# Altium project bailey-x.PrjPcb (part 6 of 8)
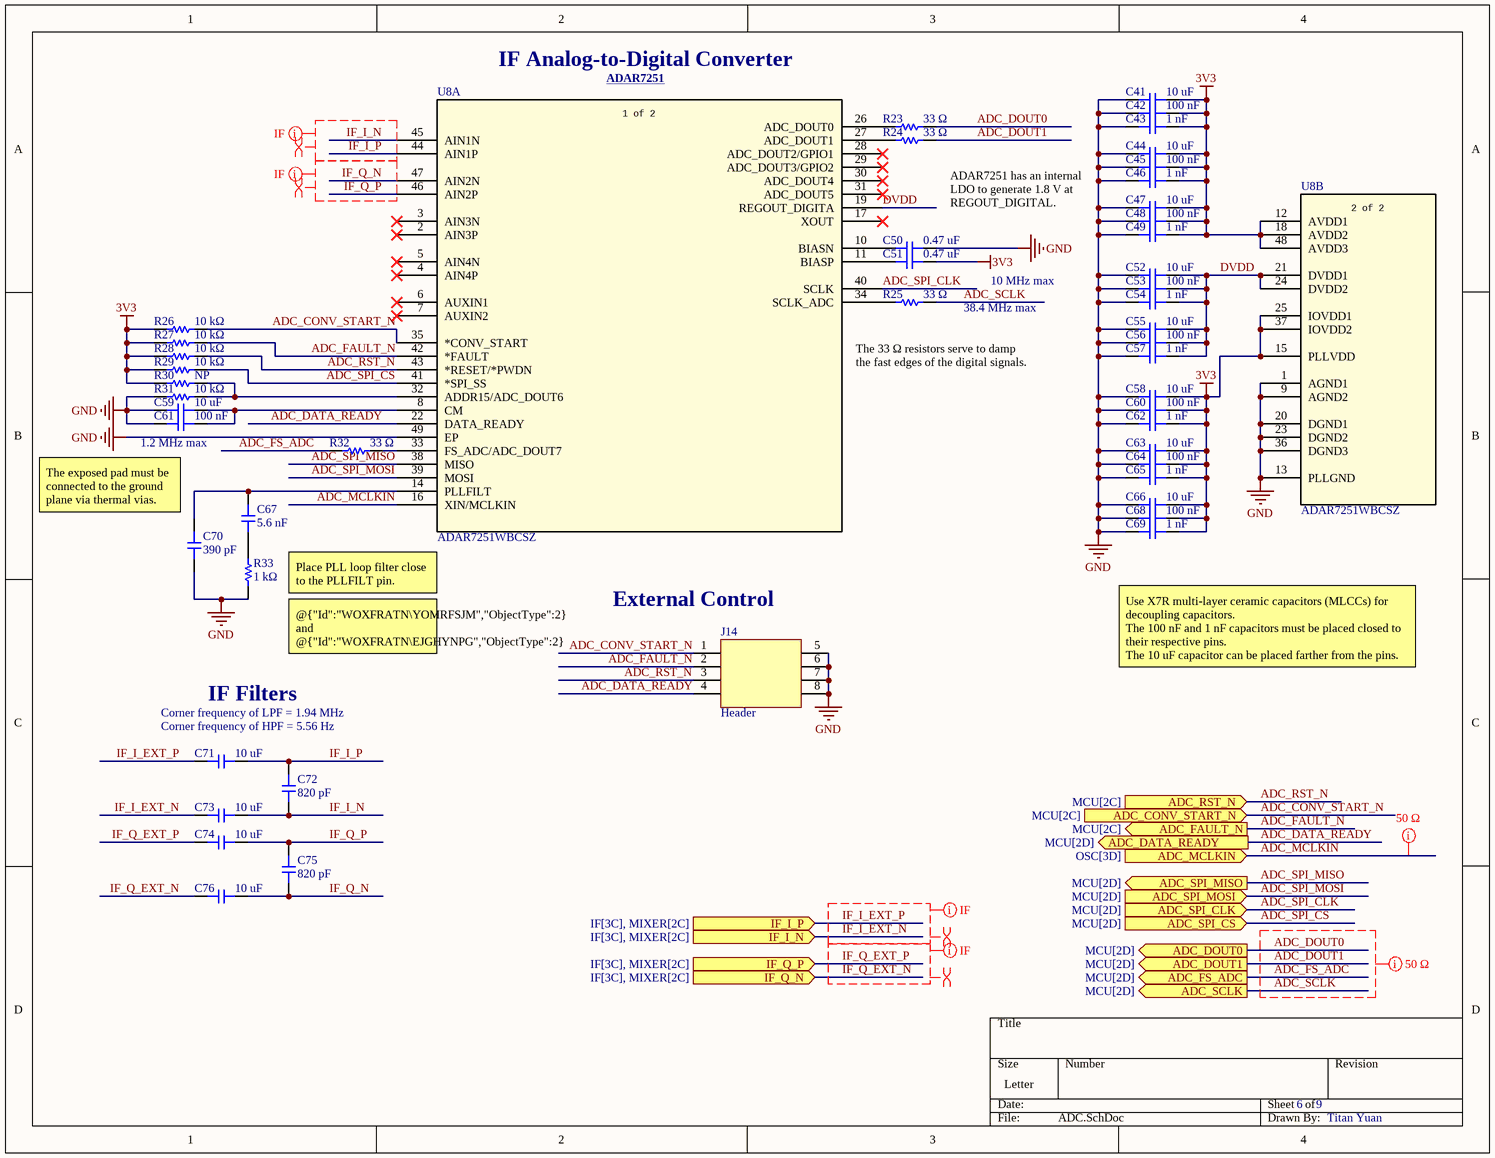
[diagram p12: ADC.SchDoc]

## Sheet ADC.SchDoc (continued)

### Library data of the parts (continued)
R26-R29 R31 = RES: Res Thick Film 0402 10K Ohm 1% 0.063W(1/16W) ±100ppm/C Pad SMD T/R; Manufacturer: Yageo; Manufacturer Part Number: RC0402FR-0710KL; Power Dissipation: 62.5mW; Power Rating: 63mW; Value: 10kΩ; Temperature Coefficient: 100ppm/°C; Voltage Rating: 50V; Tolerance: 1%; Package Size: 0402; Supplier: DigiKey; Supplier Part Number: 311-10.0KLRCT-ND; RoHS: Compliant; Category: Chip SMD Resistors; Stock: 9059080; Pricing: 1=0.1, 10=0.012, 25=0.0092, 50=0.0062, 100=0.0056, 250=0.00472, 500=0.00328, 10000=0.00204, 20000=0.00153 (USD); Case/Package: 0402; Case Code (Imperial): 0402; Case Code (Metric): 0402; China RoHS: Non-Compliant; Composition: Thick Film; Country of Origin: Mainland China, Taiwan; Depth: 500µm; Export Control Classification Number (ECCN) Code: EAR99; Height: 350µm; Harmonized Tariff Schedule (HTS) Code: 8533.21.00.30; Introduction Date: 2004-10-04; Lead Free: Lead Free; Lead Pitch: 200µm; Length: 1mm; Lifecycle Status: Production; Max Operating Temperature: 155°C; Military Standard: Not; Min Operating Temperature: -55°C; Mounting Technology: Surface Mount; Pins: 2; Number of Terminals: 2; Number of Terminations: 2; Packaging: Tape & Reel; REACH SVHC: Yes; Schedule B: 8533210045, 8533210045|8533210045|8533210045|8533210045|8533210045|8533210045|8533210045|8533210045|8533210045|8533210045|8533210045|8533210045|8533210045|8533210045, 8533210045|8533210045|8533210045|8533210045|8533210045|8533210045|8533210045|8533210045|8533210045|8533210045|8533210045|8533210045|8533210045|8533210045|8533210045, 8533210045|8533210045|8533210045|8533210045|8533210045|8533210045|8533210045|8533210045|8533210045|8533210045|8533210045|8533210045|8533210045|8533210045|8533210045|8533210045; Termination: SMD/SMT; Voltage Rating (DC): 50V; Width: 500µm; Working Voltage: 50V; ComponentLink1URL: https://datasheet.octopart.com:443/RC0402FR-0710KL-Yageo-datasheet-175887523.pdf?src-supplier=Newark; ComponentLink1Description: https://datasheet.octopart.com:443/RC0402FR-0710KL-Yageo-datasheet-175887523.pdf?src-supplier=Newark; ComponentLink2URL: https://datasheet.octopart.com:443/RC0402FR-0710KL-Yageo-datasheet-12531192.pdf?src-supplier=Newark; ComponentLink2Description: https://datasheet.octopart.com:443/RC0402FR-0710KL-Yageo-datasheet-12531192.pdf?src-supplier=Newark; ComponentLink3URL: https://datasheet.octopart.com:443/RC0402FR-0710KL-Yageo-datasheet-8324527.pdf?src-supplier=Newark; ComponentLink3Description: https://datasheet.octopart.com:443/RC0402FR-0710KL-Yageo-datasheet-8324527.pdf?src-supplier=Newark; ComponentLink4URL: https://datasheet.octopart.com:443/RC0402FR-0710KL-Yageo-datasheet-10408619.pdf?src-supplier=element14+APAC; ComponentLink4Description: https://datasheet.octopart.com:443/RC0402FR-0710KL-Yageo-datasheet-10408619.pdf?src-supplier=element14+APAC; ComponentLink5URL: https://datasheet.octopart.com:443/RC0402FR-0710KL-Yageo-datasheet-62067350.pdf?src-supplier=element14+APAC; ComponentLink5Description: https://datasheet.octopart.com:443/RC0402FR-0710KL-Yageo-datasheet-62067350.pdf?src-supplier=element14+APAC; ComponentLink6URL: https://datasheet.octopart.com:443/RC0402FR-0710KL-Yageo-datasheet-21426659.pdf?src-supplier=element14+APAC; ComponentLink6Description: https://datasheet.octopart.com:443/RC0402FR-0710KL-Yageo-datasheet-21426659.pdf?src-supplier=element14+APAC; ComponentLink7URL: https://datasheet.octopart.com:443/RC0402FR-0710KL-Yageo-datasheet-164759695.pdf?src-supplier=Upverter; ComponentLink7Description: https://datasheet.octopart.com:443/RC0402FR-0710KL-Yageo-datasheet-164759695.pdf?src-supplier=Upverter; ComponentLink8URL: https://datasheet.octopart.com:443/RC0402FR-0710KL-Yageo-datasheet-103092701.pdf?src-supplier=Upverter; ComponentLink8Description: https://datasheet.octopart.com:443/RC0402FR-0710KL-Yageo-datasheet-103092701.pdf?src-supplier=Upverter; ComponentLink9URL: https://sigma.octopart.com:443/138820526/technical_drawing/Yageo-RC0402FR-0710KL.pdf?src-supplier=Upverter; ComponentLink9Description: https://sigma.octopart.com:443/138820526/technical_drawing/Yageo-RC0402FR-0710KL.pdf?src-supplier=Upverter; ComponentLink10URL: https://datasheet.octopart.com:443/RC0402FR-0710KL-Yageo-datasheet-98239111.pdf?src-supplier=Upverter; ComponentLink10Description: https://datasheet.octopart.com:443/RC0402FR-0710KL-Yageo-datasheet-98239111.pdf?src-supplier=Upverter; ComponentLink11URL: https://datasheet.octopart.com:443/RC0402FR-0710KL-Yageo-datasheet-68298067.pdf?src-supplier=Upverter; ComponentLink11Description: https://datasheet.octopart.com:443/RC0402FR-0710KL-Yageo-datasheet-68298067.pdf?src-supplier=Upverter; ComponentLink12URL: https://datasheet.octopart.com:443/RC0402FR-0710KL-Yageo-datasheet-68297981.pdf?src-supplier=Upverter; ComponentLink12Description: https://datasheet.octopart.com:443/RC0402FR-0710KL-Yageo-datasheet-68297981.pdf?src-supplier=Upverter; ComponentLink13URL: https://datasheet.octopart.com:443/RC0402FR-0710KL-Yageo-datasheet-141435361.pdf?src-supplier=Upverter; ComponentLink13Description: https://datasheet.octopart.com:443/RC0402FR-0710KL-Yageo-datasheet-141435361.pdf?src-supplier=Upverter; ComponentLink14URL: https://datasheet.octopart.com:443/RC0402FR-0710KL-Yageo-datasheet-12509768.pdf?src-supplier=Upverter; ComponentLink14Description: https://datasheet.octopart.com:443/RC0402FR-0710KL-Yageo-datasheet-12509768.pdf?src-supplier=Upverter; ComponentLink15URL: https://datasheet.octopart.com:443/RC0402FR-0710KL-Yageo-Group-datasheet-190305687.pdf?src-supplier=Future+Electronics; ComponentLink15Description: https://datasheet.octopart.com:443/RC0402FR-0710KL-Yageo-Group-datasheet-190305687.pdf?src-supplier=Future+Electronics; ComponentLink16URL: https://datasheet.octopart.com:443/RC0402FR-0710KL-Yageo-datasheet-137700087.pdf?src-supplier=Future+Electronics; ComponentLink16Description: https://datasheet.octopart.com:443/RC0402FR-0710KL-Yageo-datasheet-137700087.pdf?src-supplier=Future+Electronics; ComponentLink17URL: https://datasheet.octopart.com:443/RC0402FR-0710KL-Yageo-datasheet-8324255.pdf?src-supplier=Future+Electronics; ComponentLink17Description: https://datasheet.octopart.com:443/RC0402FR-0710KL-Yageo-datasheet-8324255.pdf?src-supplier=Future+Electronics; ComponentLink18URL: https://datasheet.octopart.com:443/RC0402FR-0710KL-Yageo-datasheet-8329306.pdf?src-supplier=element14; ComponentLink18Description: https://datasheet.octopart.com:443/RC0402FR-0710KL-Yageo-datasheet-8329306.pdf?src-supplier=element14; ComponentLink19URL: https://datasheet.octopart.com:443/RC0402FR-0710KL-Yageo-datasheet-505231.pdf?src-supplier=element14; ComponentLink19Description: https://datasheet.octopart.com:443/RC0402FR-0710KL-Yageo-datasheet-505231.pdf?src-supplier=element14; ComponentLink20URL: https://datasheet.octopart.com:443/RC0402FR-0710KL-Yageo-datasheet-175423674.pdf?src-supplier=SOS+electronic; ComponentLink20Description: https://datasheet.octopart.com:443/RC0402FR-0710KL-Yageo-datasheet-175423674.pdf?src-supplier=SOS+electronic; ComponentLink21URL: https://datasheet.octopart.com:443/RC0402FR-0710KL-Yageo-datasheet-79472498.pdf?src-supplier=Megastar; ComponentLink21Description: https://datasheet.octopart.com:443/RC0402FR-0710KL-Yageo-datasheet-79472498.pdf?src-supplier=Megastar; ComponentLink22URL: https://datasheet.octopart.com/RC0402FR-0710KL-Yageo-datasheet-73766026.pdf; ComponentLink22Description: https://datasheet.octopart.com/RC0402FR-0710KL-Yageo-datasheet-73766026.pdf; ComponentLink23URL: http://sigma.octopart.com:80/conflict_mineral_statement/Yageo-company-3.pdf?src-supplier=Compliance+Statements; ComponentLink23Description: http://sigma.octopart.com:80/conflict_mineral_statement/Yageo-company-3.pdf?src-supplier=Compliance+Statements; ComponentLink24URL: http://sigma.octopart.com:80/rohs_statement/Yageo-company-2.pdf?src-supplier=Compliance+Statements; ComponentLink24Description: http://sigma.octopart.com:80/rohs_statement/Yageo-company-2.pdf?src-supplier=Compliance+Statements
R30 = RES: Resistor SMD Generic; Manufacturer: *; Manufacturer Part Number: *; Tolerance: *; Voltage Rating: *; Package Size: 0402
R33 = RES: Res Thin Film 0402 1K Ohm 0.1% 0.063W(1/16W) ±25ppm/C Pad SMD T/R; Manufacturer: Yageo; Manufacturer Part Number: RT0402BRD071KL; Max Power Dissipation: 63mW; Power Dissipation: 62.5mW; Value: 1kΩ; Temperature Coefficient: 25ppm/°C; Voltage Rating: 50V; Tolerance: 0.1%; Package Size: 0402; Supplier: DigiKey; Supplier Part Number: YAG1386CT-ND; RoHS: Compliant; Category: Chip SMD Resistors; Stock: 241072; Pricing: 1=0.1, 10=0.061, 25=0.0592, 50=0.0572, 100=0.0556, 250=0.05408, 500=0.04692, 1000=0.04567 (USD); Case/Package: 0402; Case Code (Imperial): 0402; China RoHS: Non-Compliant; Composition: Thin Film; Depth: 500µm; Features: Moisture Resistant; Height: 300µm; Lead Free: Lead Free; Length: 1mm; Lifecycle Status: Production; Max Operating Temperature: 155°C; Military Standard: Not; Min Operating Temperature: -55°C; Mounting Technology: Surface Mount; Number of Terminals: 2; Number of Terminations: 2; Power Rating: 63mW; REACH SVHC: Yes; Schedule B: 8533210045, 8533210045|8533210045|8533210045|8533210045|8533210045|8533210045|8533210045|8533210045|8533210045|8533210045|8533210045|8533210045|8533210045, 8533210045|8533210045|8533210045|8533210045|8533210045|8533210045|8533210045|8533210045|8533210045|8533210045|8533210045|8533210045|8533210045|8533210045, 8533210045|8533210045|8533210045|8533210045|8533210045|8533210045|8533210045|8533210045|8533210045|8533210045|8533210045|8533210045|8533210045|8533210045|8533210045; Termination: SMD/SMT; Voltage Rating (DC): 50V; Weight: 652.039032µg; Width: 500µm; Working Voltage: 50V; ComponentLink1URL: https://datasheet.octopart.com:443/RT0402BRD071KL-Yageo-datasheet-176402239.pdf?src-supplier=Future+Electronics; ComponentLink1Description: https://datasheet.octopart.com:443/RT0402BRD071KL-Yageo-datasheet-176402239.pdf?src-supplier=Future+Electronics; ComponentLink2URL: https://datasheet.octopart.com:443/RT0402BRD071KL-Yageo-datasheet-169971040.pdf?src-supplier=Future+Electronics; ComponentLink2Description: https://datasheet.octopart.com:443/RT0402BRD071KL-Yageo-datasheet-169971040.pdf?src-supplier=Future+Electronics; ComponentLink3URL: https://datasheet.octopart.com:443/RT0402BRD071KL-Yageo-datasheet-166250672.pdf?src-supplier=Future+Electronics; ComponentLink3Description: https://datasheet.octopart.com:443/RT0402BRD071KL-Yageo-datasheet-166250672.pdf?src-supplier=Future+Electronics; ComponentLink4URL: https://datasheet.octopart.com:443/RT0402BRD071KL-Yageo-datasheet-136673517.pdf?src-supplier=Future+Electronics; ComponentLink4Description: https://datasheet.octopart.com:443/RT0402BRD071KL-Yageo-datasheet-136673517.pdf?src-supplier=Future+Electronics; ComponentLink5URL: https://datasheet.octopart.com:443/RT0402BRD071KL-Yageo-datasheet-137700930.pdf?src-supplier=Future+Electronics; ComponentLink5Description: https://datasheet.octopart.com:443/RT0402BRD071KL-Yageo-datasheet-137700930.pdf?src-supplier=Future+Electronics; ComponentLink6URL: https://datasheet.octopart.com:443/RT0402BRD071KL-Yageo-datasheet-96443642.pdf?src-supplier=Future+Electronics; ComponentLink6Description: https://datasheet.octopart.com:443/RT0402BRD071KL-Yageo-datasheet-96443642.pdf?src-supplier=Future+Electronics; ComponentLink7URL: https://datasheet.octopart.com:443/RT0402BRD071KL-Yageo-datasheet-12594463.pdf?src-supplier=Future+Electronics; ComponentLink7Description: https://datasheet.octopart.com:443/RT0402BRD071KL-Yageo-datasheet-12594463.pdf?src-supplier=Future+Electronics; ComponentLink8URL: https://datasheet.octopart.com:443/RT0402BRD071KL-Yageo-datasheet-8324589.pdf?src-supplier=Future+Electronics; ComponentLink8Description: https://datasheet.octopart.com:443/RT0402BRD071KL-Yageo-datasheet-8324589.pdf?src-supplier=Future+Electronics; ComponentLink9URL: https://datasheet.octopart.com:443/RT0402BRD071KL-Yageo-datasheet-34924148.pdf?src-supplier=Future+Electronics; ComponentLink9Description: https://datasheet.octopart.com:443/RT0402BRD071KL-Yageo-datasheet-34924148.pdf?src-supplier=Future+Electronics; ComponentLink10URL: https://datasheet.octopart.com:443/RT0402BRD071KL-Yageo-datasheet-141265893.pdf?src-supplier=ODG+(Origin+Data+Global); ComponentLink10Description: https://datasheet.octopart.com:443/RT0402BRD071KL-Yageo-datasheet-141265893.pdf?src-supplier=ODG+(Origin+Data+Global); ComponentLink11URL: https://sigma.octopart.com:443/138820526/technical_drawing/Yageo-RT0402BRD071KL.pdf?src-supplier=Upverter; ComponentLink11Description: https://sigma.octopart.com:443/138820526/technical_drawing/Yageo-RT0402BRD071KL.pdf?src-supplier=Upverter; ComponentLink12URL: https://datasheet.octopart.com:443/RT0402BRD071KL-Yageo-datasheet-10915759.pdf?src-supplier=TME; ComponentLink12Description: https://datasheet.octopart.com:443/RT0402BRD071KL-Yageo-datasheet-10915759.pdf?src-supplier=TME; ComponentLink13URL: https://datasheet.octopart.com:443/RT0402BRD071KL-Yageo-datasheet-164439670.pdf?src-supplier=Newark; ComponentLink13Description: https://datasheet.octopart.com:443/RT0402BRD071KL-Yageo-datasheet-164439670.pdf?src-supplier=Newark; ComponentLink14URL: https://datasheet.octopart.com:443/RT0402BRD071KL-Yageo-datasheet-120102479.pdf?src-supplier=Megastar; ComponentLink14Description: https://datasheet.octopart.com:443/RT0402BRD071KL-Yageo-datasheet-120102479.pdf?src-supplier=Megastar; ComponentLink15URL: https://datasheet.octopart.com/RT0402BRD071KL-Yageo-datasheet-86813807.pdf; ComponentLink15Description: https://datasheet.octopart.com/RT0402BRD071KL-Yageo-datasheet-86813807.pdf; ComponentLink16URL: http://sigma.octopart.com:80/conflict_mineral_statement/Yageo-company-3.pdf?src-supplier=Compliance+Statements; ComponentLink16Description: http://sigma.octopart.com:80/conflict_mineral_statement/Yageo-company-3.pdf?src-supplier=Compliance+Statements; ComponentLink17URL: http://sigma.octopart.com:80/rohs_statement/Yageo-company-2.pdf?src-supplier=Compliance+Statements; ComponentLink17Description: http://sigma.octopart.com:80/rohs_statement/Yageo-company-2.pdf?src-supplier=Compliance+Statements
U8 = ADAR7251WBCSZ: 4-Channel Quad ADC Delta-Sigma 1.8Msps 16-bit Parallel/Serial Automotive 48-Pin LFCSP EP T/R; Manufacturer_Name: Analog Devices Inc; Manufacturer: Analog Devices; Manufacturer Lifecycle Status: NOT RECOMMENDED FOR NEW DESIGN; Interface: Parallel, SPI; Number of A/D Converters: 4; Number of Bits: 16; Copyright: Copyright (C) 2025 Ultra Librarian. All rights reserved.; Manufacturer_Part_Number: ADAR7251WBCSZ; Datasheet: https://www.analog.com/media/en/technical-documentation/data-sheets/ADAR7251.pdf; RefDes: RefDes; Type: Type; Supplier: Arrow Electronics; Supplier Part Number: ADAR7251WBCSZ-RL; Manufacturer Part Number: ADAR7251WBCSZ; RoHS: Compliant; Category: Analog to Digital Converters (ADCs); Stock: 1518; Pricing: 1=17.58, 10=17.31, 25=17.04, 100=16.77, 250=16.49, 500=16.22, 1000=15.95 (USD); Case/Package: QFN; Lead Free: Contains Lead; Lifecycle Status: Production; Max Operating Temperature: 125°C; Min Operating Temperature: -40°C; Number of Inputs: 4; Pins: 48; Packaging: Tape and Reel; Sampling Rate: 1.8Msps; Schedule B: 8542390000, 8542390000|8542390000|8542390000|8542390000|8542390000; ComponentLink1URL: https://datasheet.octopart.com:443/ADAR7251WBCSZ-RL-Analog-Devices-datasheet-37108182.pdf?src-supplier=Upverter; ComponentLink1Description: https://datasheet.octopart.com:443/ADAR7251WBCSZ-RL-Analog-Devices-datasheet-37108182.pdf?src-supplier=Upverter; ComponentLink2URL: https://octopart.com:443/opatz8j6/c1?t=CQmgxgzF3TS1DSQPN3cDiG0EYWfU1hgwPhmTexDVZLnR1yZQOElAuyPbML9mgDJkPVxpVD3gYcoY03UYbhc9VkRaca9L0HaHtXuMsNFf2r7kStaMExwc3y8Qy8XWZPSfY4husBBcSXxc0bo4wKO_VIhVldzI7K2uCW-t-YqmoWcieXASzNGiaG2Bub2XzkGmAw1BAALsiXjrYth_GIRcMxKMuexNTsFZxWzEW-RJC1yoCn1dh43rOqnwSWnkt7ugxSJEi6_2jxpsji6pZNy2X20IdN1ynU6w9VyR75RcBgi_pduDOVpUW0AX&src-supplier=Analog+Devices; ComponentLink2Description: https://octopart.com:443/opatz8j6/c1?t=CQmgxgzF3TS1DSQPN3cDiG0EYWfU1hgwPhmTexDVZLnR1yZQOElAuyPbML9mgDJkPVxpVD3gYcoY03UYbhc9VkRaca9L0HaHtXuMsNFf2r7kStaMExwc3y8Qy8XWZPSfY4husBBcSXxc0bo4wKO_VIhVldzI7K2uCW-t-YqmoWcieXASzNGiaG2Bub2XzkGmAw1BAALsiXjrYth_GIRcMxKMuexNTsFZxWzEW-RJC1yoCn1dh43rOqnwSWnkt7ugxSJEi6_2jxpsji6pZNy2X20IdN1ynU6w9VyR75RcBgi_pduDOVpUW0AX&src-supplier=Analog+Devices; ComponentLink3URL: https://datasheet.octopart.com:443/ADAR7251WBCSZ-RL-Analog-Devices-datasheet-79793795.pdf?src-supplier=SHENGYU+ELECTRONICS; ComponentLink3Description: https://datasheet.octopart.com:443/ADAR7251WBCSZ-RL-Analog-Devices-datasheet-79793795.pdf?src-supplier=SHENGYU+ELECTRONICS; ComponentLink4URL: http://sigma.octopart.com:80/conflict_mineral_statement/Analog-Devices-company-33.pdf?src-supplier=Compliance+Statements; ComponentLink4Description: http://sigma.octopart.com:80/conflict_mineral_statement/Analog-Devices-company-33.pdf?src-supplier=Compliance+Statements; ComponentLink5URL: https://octopart.com:443/opatz8j6/c1?t=QP5QRZ8fNHIlvGQJKDbEcehpvKXZdY016AwOjUrM50DrZC_R-f1Pg-EuaWOyKDZH9OBd7dWivR_i3nk3Xo26w2sGsBnPhkVsSzYG81pmL3ea60Kmr0a8UUo0ZL-YYfNFq7KTASlEeG1WvdeIoSBT5hBvzH64l4FkDtEivSQbImbmNw6Y08ax0d8WdYuFh5ejQZzFivnYTWpTOoJzNsRVn8w6iClEFe_CmzJzioseeE7rWrtas6d9CbFF5KEvx48S6-N7O0YoKKepe4BUbaANJTYqghQhF1t7el8qVACiHhz-ck11jaWvVU3U&src-supplier=Compliance+Statements; ComponentLink5Description: https://octopart.com:443/opatz8j6/c1?t=QP5QRZ8fNHIlvGQJKDbEcehpvKXZdY016AwOjUrM50DrZC_R-f1Pg-EuaWOyKDZH9OBd7dWivR_i3nk3Xo26w2sGsBnPhkVsSzYG81pmL3ea60Kmr0a8UUo0ZL-YYfNFq7KTASlEeG1WvdeIoSBT5hBvzH64l4FkDtEivSQbImbmNw6Y08ax0d8WdYuFh5ejQZzFivnYTWpTOoJzNsRVn8w6iClEFe_CmzJzioseeE7rWrtas6d9CbFF5KEvx48S6-N7O0YoKKepe4BUbaANJTYqghQhF1t7el8qVACiHhz-ck11jaWvVU3U&src-supplier=Compliance+Statements

## Sheet OSC.SchDoc
size Letter; DrawnBy: Titan Yuan; SheetNumber: 7; SheetTotal: 9
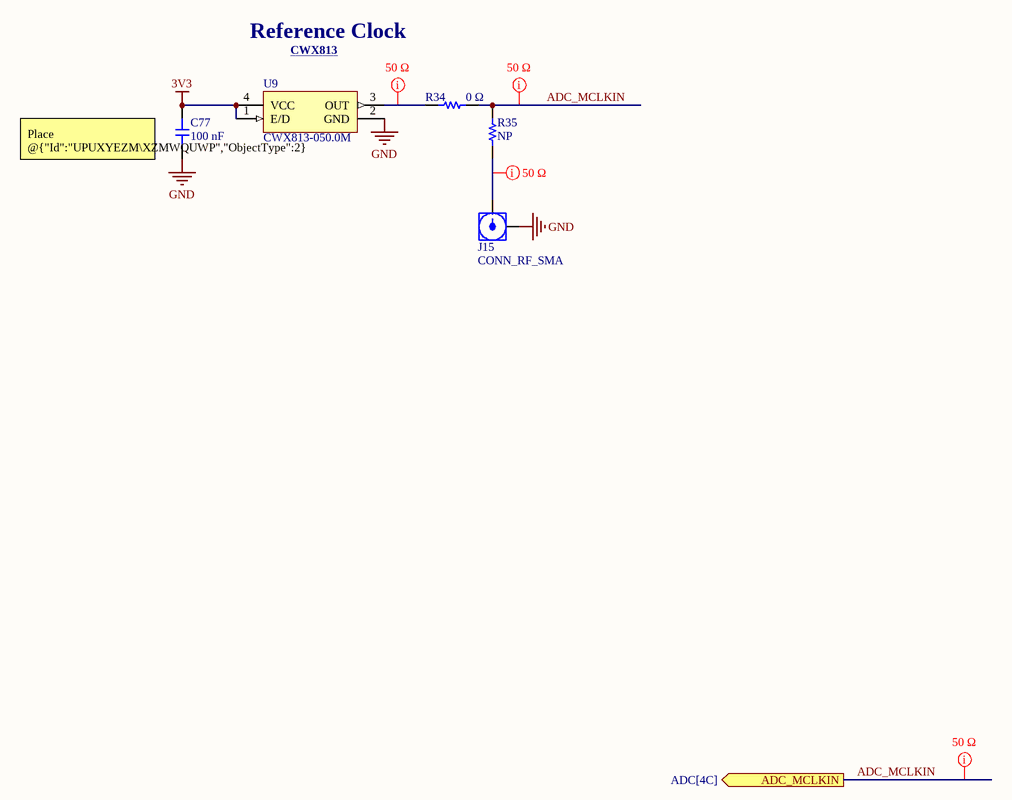
[diagram p6: OSC.SchDoc]

### Parts
C77  100 nF  [CAP_0402]
J15  CONN_RF_SMA  [142-0701-801]
R34  0 Ω  [RES_0402]
R35  NP  [RES_0402]
U9  CWX813-050.0M  [CWX8XX]

### Ports
ADC_MCLKIN (out, see ADC[4C])

### Nets
3V3: C77.2 U9.1(E/D) U9.4(VCC)
GND: C77.1 J15.2 U9.2(GND)
ADC_MCLKIN: R34.2 R35.2 ; port ADC_MCLKIN
NetJ15_1: J15.1 R35.1
NetR34_1: R34.1 U9.3(OUT)

### Layout directives
net class 50 Ω: ADC_MCLKIN, NetJ15_1, NetR34_1

### Notes on the sheet
- Reference Clock
- (near U9) CWX813 <https://www.conwin.com/datasheets/sm/sm111.pdf>
- (near C77) Place @{"Id":"UPUXYEZM\XZMWQUWP","ObjectType":2} right next to pin 2 of @{"Id":"UPUXYEZM\QIVNDBVN","ObjectType":2}.

### Library data of the parts
C77 = CAP: Ceramic Capacitor, Ceramic, 50V, 10% +Tol, 10% -Tol, X7R, 15% TC, 0.1uF, Surface Mount, 0402; Manufacturer: Yageo; Manufacturer Part Number: CC0402KPX7R9BB104; Tolerance: +-10%; Value: 100nF; Voltage Rating: 50 V; Dielectric: Ceramic; Package Size: 0402; Supplier: DigiKey; Supplier Part Number: 13-CC0402KPX7R9BB104CT-ND; RoHS: Compliant; Category: Ceramic Capacitors; Stock: 40680; Pricing: 1=0.1, 10=0.053, 50=0.0364, 100=0.0313, 500=0.02292, 1000=0.02035, 2500=0.01764, 5000=0.01601 (USD); Case/Package: 0402; China RoHS: Compliant; Dielectric Material: Ceramic; Height: 500µm; Lead Free: Lead Free; Length: 1mm; Lifecycle Status: Production; Max Operating Temperature: 125°C; Min Operating Temperature: -55°C; Mounting Technology: Surface Mount; Number of Terminals: 2; REACH SVHC: Yes; Voltage Rating (DC): 50V; Width: 500µm; ComponentLink1URL: https://datasheet.octopart.com:443/CC0402KPX7R9BB104-Yageo-datasheet-177165144.pdf?src-supplier=IHS; ComponentLink1Description: https://datasheet.octopart.com:443/CC0402KPX7R9BB104-Yageo-datasheet-177165144.pdf?src-supplier=IHS; ComponentLink2URL: https://datasheet.octopart.com:443/CC0402KPX7R9BB104-Yageo-Group-datasheet-189192896.pdf?src-supplier=Future+Electronics; ComponentLink2Description: https://datasheet.octopart.com:443/CC0402KPX7R9BB104-Yageo-Group-datasheet-189192896.pdf?src-supplier=Future+Electronics; ComponentLink3URL: https://datasheet.octopart.com:443/CC0402KPX7R9BB104-Yageo-datasheet-181967134.pdf?src-supplier=Farnell; ComponentLink3Description: https://datasheet.octopart.com:443/CC0402KPX7R9BB104-Yageo-datasheet-181967134.pdf?src-supplier=Farnell; ComponentLink4URL: https://datasheet.octopart.com/Surface-Mount-Ceramic-Multilayer-Capacitors%3B-General-Purpose-%26-High-Capacitance-Class-2%2C-X7R-Yageo-datasheet-family-114.pdf; ComponentLink4Description: https://datasheet.octopart.com/Surface-Mount-Ceramic-Multilayer-Capacitors%3B-General-Purpose-%26-High-Capacitance-Class-2%2C-X7R-Yageo-datasheet-family-114.pdf; ComponentLink5URL: https://datasheet.octopart.com/CC0402KPX7R9BB104-Yageo-datasheet-10883670.pdf; ComponentLink5Description: https://datasheet.octopart.com/CC0402KPX7R9BB104-Yageo-datasheet-10883670.pdf; ComponentLink6URL: http://sigma.octopart.com:80/rohs_statement/Surface-Mount-Ceramic-Multilayer-Capacitors%3B-General-Purpose-%26-High-Capacitance-Class-2%2C-X7R-Yageo-family-124.pdf?src-supplier=Compliance+Statements; ComponentLink6Description: http://sigma.octopart.com:80/rohs_statement/Surface-Mount-Ceramic-Multilayer-Capacitors%3B-General-Purpose-%26-High-Capacitance-Class-2%2C-X7R-Yageo-family-124.pdf?src-supplier=Compliance+Statements; ComponentLink7URL: http://sigma.octopart.com:80/reach_statement/Surface-Mount-Ceramic-Multilayer-Capacitors%3B-General-Purpose-%26-High-Capacitance-Class-2%2C-X7R-Yageo-family-125.pdf?src-supplier=Compliance+Statements; ComponentLink7Description: http://sigma.octopart.com:80/reach_statement/Surface-Mount-Ceramic-Multilayer-Capacitors%3B-General-Purpose-%26-High-Capacitance-Class-2%2C-X7R-Yageo-family-125.pdf?src-supplier=Compliance+Statements; ComponentLink8URL: http://sigma.octopart.com:80/conflict_mineral_statement/Yageo-company-3.pdf?src-supplier=Compliance+Statements; ComponentLink8Description: http://sigma.octopart.com:80/conflict_mineral_statement/Yageo-company-3.pdf?src-supplier=Compliance+Statements; ComponentLink9URL: http://sigma.octopart.com:80/rohs_statement/Yageo-company-2.pdf?src-supplier=Compliance+Statements; ComponentLink9Description: http://sigma.octopart.com:80/rohs_statement/Yageo-company-2.pdf?src-supplier=Compliance+Statements
J15 = CONN_RF_SMA: RF / Coaxial Connector, SMA Coaxial, Straight Jack, Solder, 50 ohm, Beryllium Copper; Manufacturer: Cinch Connectivity Solutions Johnson; Maximum Frequency: 18 GHz; Body Material: Brass; Body Plating: Gold; Connector Type: Coaxial, PCB, SMA, Socket; Contact Resistance: 4mΩ; Dielectric Material: PTFE; Frequency: 18GHz; Gender: Female; Impedance: 50Ω; Insulation Resistance: 5GΩ; Number of Contacts: 1; Polarity: Normal; Voltage Rating: 335V; Manufacturer Part Number: 142-0701-801; Supplier: DigiKey; Supplier Part Number: J502-ND; RoHS: Compliant; Category: RF / Coaxial Connectors; Stock: 35108; Pricing: 1=3.73, 10=3.166, 25=2.9676, 50=2.826, 100=2.691, 250=2.52244, 500=2.40206, 1000=2.28748, 2500=2.1444 (USD); Case/Package: SMA; Contact Gender: Female; Contact Material: Gold, Nickel; Contact Plating: Gold; Depth: 25.58mm; Export Control Classification Number (ECCN) Code: EAR99; Fastening Type: Threaded; Height: 9.779mm; Housing Color: Gold; Housing Material: Brass; Harmonized Tariff Schedule (HTS) Code: 8536.69.40.10; Insulation Material: PTFE; Introduction Date: 1994-06-01; Lead Free: Lead Free; Length: 9.52mm; Lifecycle Status: Production; Clock Frequency: 18GHz; Max Operating Temperature: 165°C; Min Operating Temperature: -65°C; Mounting Technology: Edge, PCB; Pins: 1; Number of Ports: 1; Orientation: Straight; Radiation Hardening: No; REACH SVHC: No; Schedule B: 8536695050, 8536695050|8536695050|8536695050|8536695050|8536695050; Shell Material: Brass; Termination: Solder; ComponentLink1URL: https://datasheet.octopart.com:443/142-0701-801-Cinch-Connectors-datasheet-38159423.pdf?src-supplier=element14+APAC; ComponentLink1Description: https://datasheet.octopart.com:443/142-0701-801-Cinch-Connectors-datasheet-38159423.pdf?src-supplier=element14+APAC; ComponentLink2URL: https://datasheet.octopart.com:443/142-0701-801-Cinch-Connectivity-Solutions-datasheet-128878268.pdf?src-supplier=JRH+Electronics; ComponentLink2Description: https://datasheet.octopart.com:443/142-0701-801-Cinch-Connectivity-Solutions-datasheet-128878268.pdf?src-supplier=JRH+Electronics; ComponentLink3URL: https://datasheet.octopart.com:443/142-0701-801-Cinch-Connectivity-Solutions-datasheet-180501451.pdf?src-supplier=IHS; ComponentLink3Description: https://datasheet.octopart.com:443/142-0701-801-Cinch-Connectivity-Solutions-datasheet-180501451.pdf?src-supplier=IHS; ComponentLink4URL: https://datasheet.octopart.com:443/142-0701-801-Cinch-Connectivity-Solutions-datasheet-182240672.pdf?src-supplier=IHS; ComponentLink4Description: https://datasheet.octopart.com:443/142-0701-801-Cinch-Connectivity-Solutions-datasheet-182240672.pdf?src-supplier=IHS; ComponentLink5URL: https://datasheet.octopart.com:443/142-0701-801-Emerson-datasheet-182246267.pdf?src-supplier=IHS; ComponentLink5Description: https://datasheet.octopart.com:443/142-0701-801-Emerson-datasheet-182246267.pdf?src-supplier=IHS; ComponentLink6URL: https://datasheet.octopart.com:443/142-0701-801-Emerson-Network-Power-datasheet-40124.pdf?src-supplier=Newark; ComponentLink6Description: https://datasheet.octopart.com:443/142-0701-801-Emerson-Network-Power-datasheet-40124.pdf?src-supplier=Newark; ComponentLink7URL: https://datasheet.octopart.com:443/142-0701-801-Cinch-Connectors-datasheet-24914353.pdf?src-supplier=Electro+Sonic; ComponentLink7Description: https://datasheet.octopart.com:443/142-0701-801-Cinch-Connectors-datasheet-24914353.pdf?src-supplier=Electro+Sonic; ComponentLink8URL: https://datasheet.octopart.com:443/142-0701-801-Emerson-Network-Power-datasheet-14433785.pdf?src-supplier=Farnell; ComponentLink8Description: https://datasheet.octopart.com:443/142-0701-801-Emerson-Network-Power-datasheet-14433785.pdf?src-supplier=Farnell; ComponentLink9URL: https://datasheet.octopart.com:443/142-0701-801-Emerson-Network-Power-datasheet-8828422.pdf?src-supplier=Farnell; ComponentLink9Description: https://datasheet.octopart.com:443/142-0701-801-Emerson-Network-Power-datasheet-8828422.pdf?src-supplier=Farnell; ComponentLink10URL: https://datasheet.octopart.com:443/142-0701-801-Emerson-Network-Power-datasheet-10031126.pdf?src-supplier=Farnell; ComponentLink10Description: https://datasheet.octopart.com:443/142-0701-801-Emerson-Network-Power-datasheet-10031126.pdf?src-supplier=Farnell; ComponentLink11URL: https://datasheet.octopart.com:443/142-0701-801-Emerson-Network-Power-datasheet-47159.pdf?src-supplier=Farnell; ComponentLink11Description: https://datasheet.octopart.com:443/142-0701-801-Emerson-Network-Power-datasheet-47159.pdf?src-supplier=Farnell; ComponentLink12URL: https://datasheet.octopart.com:443/142-0701-801-Emerson-Network-Power-datasheet-29036.pdf?src-supplier=Farnell; ComponentLink12Description: https://datasheet.octopart.com:443/142-0701-801-Emerson-Network-Power-datasheet-29036.pdf?src-supplier=Farnell; ComponentLink13URL: https://datasheet.octopart.com:443/142-0701-801-Semflex-datasheet-33021794.pdf?src-supplier=East+Coast+Microwave; ComponentLink13Description: https://datasheet.octopart.com:443/142-0701-801-Semflex-datasheet-33021794.pdf?src-supplier=East+Coast+Microwave; ComponentLink14URL: https://datasheet.octopart.com:443/142-0701-801-Emerson-datasheet-31818286.pdf?src-supplier=East+Coast+Microwave; ComponentLink14Description: https://datasheet.octopart.com:443/142-0701-801-Emerson-datasheet-31818286.pdf?src-supplier=East+Coast+Microwave; ComponentLink15URL: https://datasheet.octopart.com:443/142-0701-801-Cinch-Connectors-datasheet-27682.pdf?src-supplier=RS+(Formerly+Allied+Electronics); ComponentLink15Description: https://datasheet.octopart.com:443/142-0701-801-Cinch-Connectors-datasheet-27682.pdf?src-supplier=RS+(Formerly+Allied+Electronics); ComponentLink16URL: https://datasheet.octopart.com:443/142-0701-801-Emerson-Network-Power-datasheet-644257.pdf?src-supplier=Future+Electronics; ComponentLink16Description: https://datasheet.octopart.com:443/142-0701-801-Emerson-Network-Power-datasheet-644257.pdf?src-supplier=Future+Electronics; ComponentLink17URL: https://datasheet.octopart.com:443/142-0701-801-Emerson-Network-Power-datasheet-55164.pdf?src-supplier=_legacy+Avnet; ComponentLink17Description: https://datasheet.octopart.com:443/142-0701-801-Emerson-Network-Power-datasheet-55164.pdf?src-supplier=_legacy+Avnet
R34 = RES: GENERAL PURPOSE CHIP RESISTOR Metal Glaze/thick Film, 0.0625W, 0ohm, Surface Mount, 0402; Manufacturer: Yageo; Manufacturer Part Number: RC0402FR-070RL; Power Rating: 1/16 W; Power Dissipation: 62.5mW; Value: 0Ω; Voltage Rating: 50V; Tolerance: *; Package Size: 0402; Supplier: DigiKey; Supplier Part Number: 311-0.0LRCT-ND; RoHS: Compliant; Category: Chip SMD Resistors; Stock: 6847013; Pricing: 1=0.1, 10=0.010, 25=0.0064, 50=0.0054, 100=0.0047, 250=0.00392, 500=0.00346, 1000=0.00304, 5000=0.0023 (USD); Case/Package: 0402; Case Code (Imperial): 0402; Case Code (Metric): 1005; China RoHS: Non-Compliant; Composition: Thick Film; Contact Plating: Tin; Country of Origin: Mainland China, Taiwan; Export Control Classification Number (ECCN) Code: EAR99; Height: 350µm; Harmonized Tariff Schedule (HTS) Code: 8533.21.00.30; Introduction Date: 2004-09-22; Lead Free: Lead Free; Length: 1mm; Lifecycle Status: Production; Max Operating Temperature: 155°C; Min Operating Temperature: -55°C; Mounting Technology: Surface Mount; Number of Terminals: 2; Packaging: Tape & Reel; Radiation Hardening: No; REACH SVHC: Yes; Termination: SMD/SMT; Width: 500µm; ComponentLink1URL: https://datasheet.octopart.com:443/RC0402FR-070RL-Yageo-datasheet-141265859.pdf?src-supplier=Upverter; ComponentLink1Description: https://datasheet.octopart.com:443/RC0402FR-070RL-Yageo-datasheet-141265859.pdf?src-supplier=Upverter; ComponentLink2URL: https://sigma.octopart.com:443/138820526/technical_drawing/Yageo-RC0402FR-070RL.pdf?src-supplier=Upverter; ComponentLink2Description: https://sigma.octopart.com:443/138820526/technical_drawing/Yageo-RC0402FR-070RL.pdf?src-supplier=Upverter; ComponentLink3URL: https://datasheet.octopart.com:443/RC0402FR-070RL-Yageo-datasheet-12531192.pdf?src-supplier=IHS; ComponentLink3Description: https://datasheet.octopart.com:443/RC0402FR-070RL-Yageo-datasheet-12531192.pdf?src-supplier=IHS; ComponentLink4URL: https://datasheet.octopart.com:443/RC0402FR-070RL-Yageo-Group-datasheet-176638170.pdf?src-supplier=Future+Electronics; ComponentLink4Description: https://datasheet.octopart.com:443/RC0402FR-070RL-Yageo-Group-datasheet-176638170.pdf?src-supplier=Future+Electronics; ComponentLink5URL: https://datasheet.octopart.com:443/RC0402FR-070RL-Yageo-datasheet-164759695.pdf?src-supplier=Future+Electronics; ComponentLink5Description: https://datasheet.octopart.com:443/RC0402FR-070RL-Yageo-datasheet-164759695.pdf?src-supplier=Future+Electronics; ComponentLink6URL: https://datasheet.octopart.com:443/RC0402FR-070RL-Yageo-datasheet-137700087.pdf?src-supplier=Future+Electronics; ComponentLink6Description: https://datasheet.octopart.com:443/RC0402FR-070RL-Yageo-datasheet-137700087.pdf?src-supplier=Future+Electronics; ComponentLink7URL: https://datasheet.octopart.com:443/RC0402FR-070RL-Yageo-datasheet-10408619.pdf?src-supplier=Future+Electronics; ComponentLink7Description: https://datasheet.octopart.com:443/RC0402FR-070RL-Yageo-datasheet-10408619.pdf?src-supplier=Future+Electronics; ComponentLink8URL: https://datasheet.octopart.com:443/RC0402FR-070RL-Yageo-datasheet-8324527.pdf?src-supplier=Future+Electronics; ComponentLink8Description: https://datasheet.octopart.com:443/RC0402FR-070RL-Yageo-datasheet-8324527.pdf?src-supplier=Future+Electronics; ComponentLink9URL: https://datasheet.octopart.com:443/RC0402FR-070RL-Yageo-datasheet-79472498.pdf?src-supplier=Megastar; ComponentLink9Description: https://datasheet.octopart.com:443/RC0402FR-070RL-Yageo-datasheet-79472498.pdf?src-supplier=Megastar; ComponentLink10URL: https://datasheet.octopart.com/RC0402FR-070RL-Yageo-datasheet-73766026.pdf; ComponentLink10Description: https://datasheet.octopart.com/RC0402FR-070RL-Yageo-datasheet-73766026.pdf; ComponentLink11URL: http://sigma.octopart.com:80/conflict_mineral_statement/Yageo-company-3.pdf?src-supplier=Compliance+Statements; ComponentLink11Description: http://sigma.octopart.com:80/conflict_mineral_statement/Yageo-company-3.pdf?src-supplier=Compliance+Statements; ComponentLink12URL: http://sigma.octopart.com:80/rohs_statement/Yageo-company-2.pdf?src-supplier=Compliance+Statements; ComponentLink12Description: http://sigma.octopart.com:80/rohs_statement/Yageo-company-2.pdf?src-supplier=Compliance+Statements
R35 = RES: Resistor SMD Generic; Manufacturer: *; Manufacturer Part Number: *; Tolerance: *; Power Rating: *; Package Size: 0402
U9 = CWX813-050.0M: LVCMOS Output Clock Oscillator, 50MHz Nom; Manufacturer: Connor-Winfield; Frequency Stability: +-25 ppm; Supply Voltage: 3.3 V; Body Material: Ceramic; Fall Time: 6ns; Load Capacitance: 15pF; Max Supply Current: 30mA; Max Supply Voltage: 3.465V; Min Supply Voltage: 3.135V; Operating Supply Voltage: 3.3V; Manufacturer Part Number: CWX813-050.0M; Frequency: 50 MHz; Temperature Range: -20C to 70C; Supplier: DigiKey; Supplier Part Number: CW541CT-ND; RoHS: Compliant; Category: Oscillators; Stock: 2464; Pricing: 1=4.46, 10=3.878, 25=3.6668, 50=3.5152, 100=3.37, 250=3.28952 (USD); Case/Package: SMD/SMT; Height: 1.2954mm; Lead Free: Lead Free; Length: 7.0104mm; Lifecycle Status: Production; Max Operating Temperature: 70°C; Min Operating Temperature: -20°C; Mounting Technology: Surface Mount; Nominal Supply Current: 30mA; Number of Terminals: 4; Output Type: LVCMOS; REACH SVHC: Yes; Rise Time: 6ns; Width: 5.0038mm; ComponentLink1URL: https://datasheet.octopart.com:443/CWX813-050.0M-Connor-Winfield-datasheet-14434119.pdf?src-supplier=IHS; ComponentLink1Description: https://datasheet.octopart.com:443/CWX813-050.0M-Connor-Winfield-datasheet-14434119.pdf?src-supplier=IHS

## Sheet POWER.SchDoc
size Letter; DrawnBy: Titan Yuan; SheetNumber: 8; SheetTotal: 9
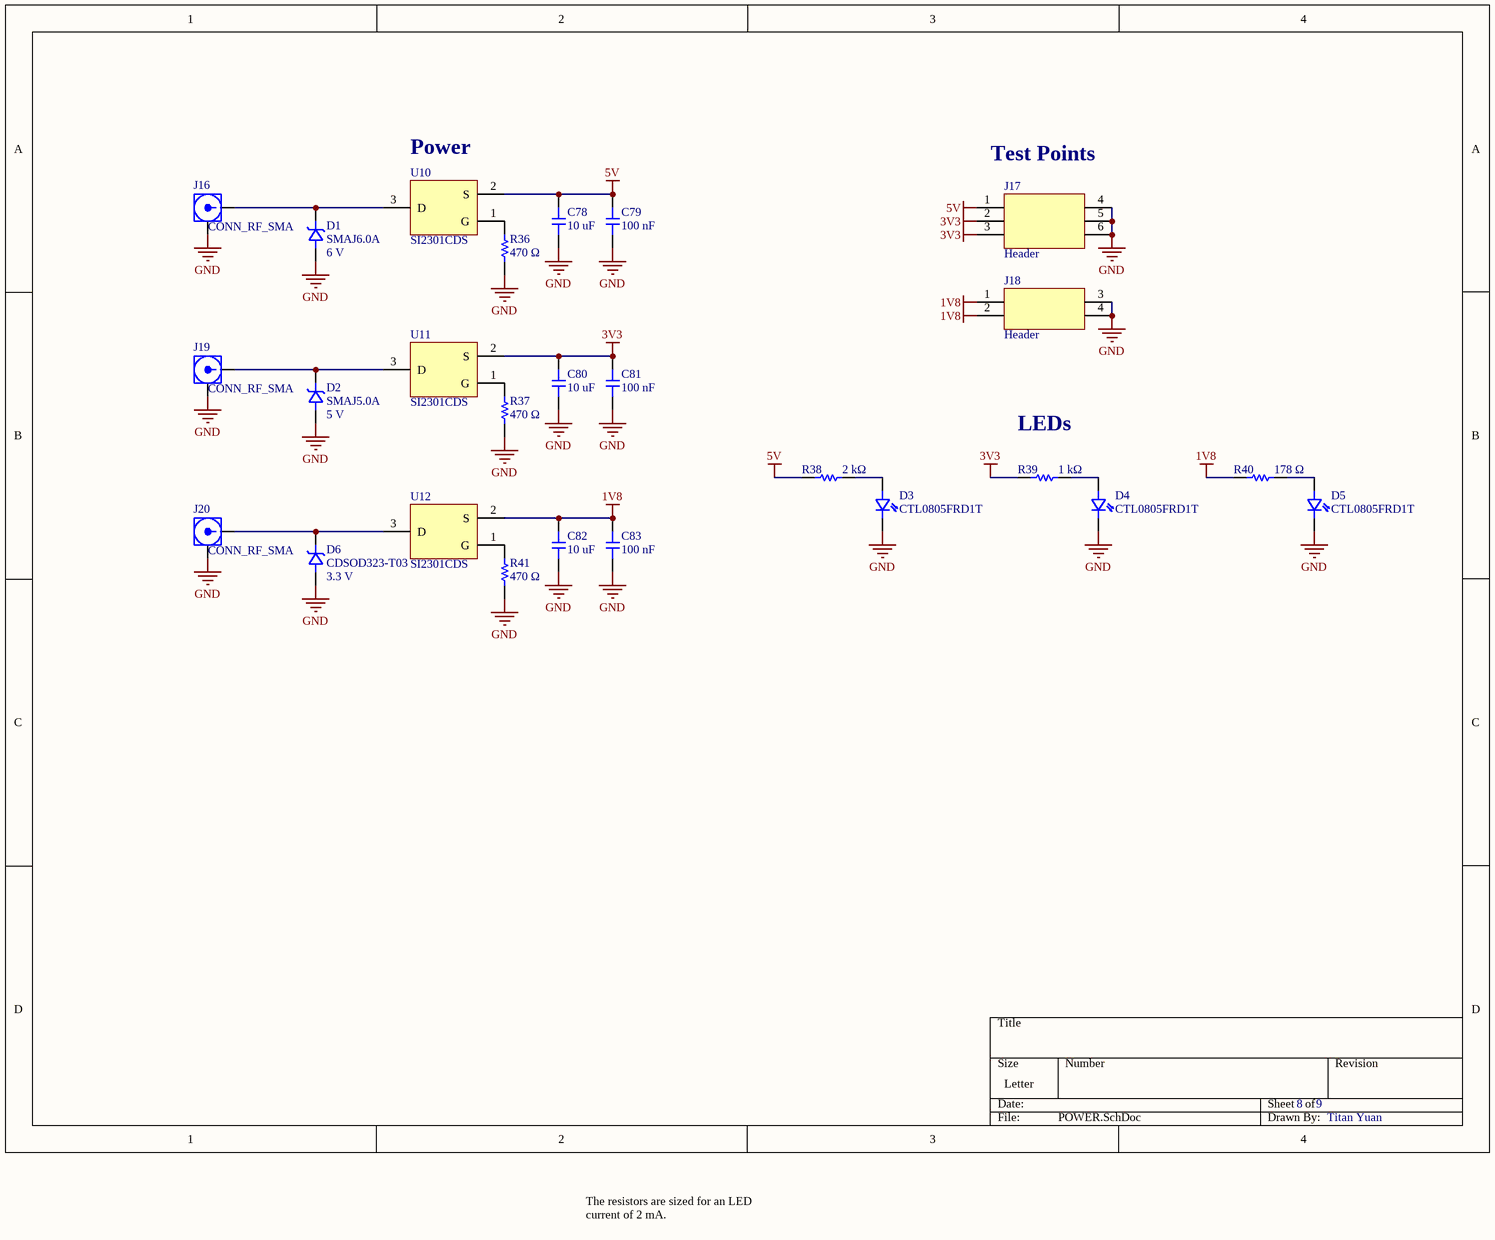
[diagram p7: POWER.SchDoc]

### Parts
C78  10 uF  [CAP_0603]
C79  100 nF  [CAP_0402]
C80  10 uF  [CAP_0603]
C81  100 nF  [CAP_0402]
C82  10 uF  [CAP_0603]
C83  100 nF  [CAP_0402]
D1  SMAJ6.0A  Reverse Standoff Voltage: 6 V  [SMAJ]
D2  SMAJ5.0A  Reverse Standoff Voltage: 5 V  [SMAJ]
D3  CTL0805FRD1T  [CTL0805FRD1T]
D4  CTL0805FRD1T  [CTL0805FRD1T]
D5  CTL0805FRD1T  [CTL0805FRD1T]
D6  CDSOD323-T03  Reverse Standoff Voltage: 3.3 V  [CDSOD323]
J16  CONN_RF_SMA  [142-0701-801]
J17  Header  [CONN_2x3_2.54mm_PinHeader_Vertical]
J18  Header  [CONN_2x2_2.54mm_PinHeader_Vertical]
J19  CONN_RF_SMA  [142-0701-801]
J20  CONN_RF_SMA  [142-0701-801]
R36  470 Ω  [RES_0402]
R37  470 Ω  [RES_0402]
R38  2 kΩ  [RES_0603]
R39  1 kΩ  [RES_0603]
R40  178 Ω  [RES_0603]
R41  470 Ω  [RES_0402]
U10  SI2301CDS  [SI2301CDS]
U11  SI2301CDS  [SI2301CDS]
U12  SI2301CDS  [SI2301CDS]

### Nets
1V8: C82.2 C83.2 J18.1 J18.2 R40.1 U12.2(S)
3V3: C80.2 C81.2 J17.2 J17.3 R39.1 U11.2(S)
5V: C78.2 C79.2 J17.1 R38.1 U10.2(S)
GND: C78.1 C79.1 C80.1 C81.1 C82.1 C83.1 D1.2 D2.2 D3.1 D4.1 D5.1 D6.2 J16.2 J17.4 J17.5 J17.6 J18.3 J18.4 J19.2 J20.2 R36.1 R37.1 R41.1
NetD1_1: D1.1 J16.1 U10.3(D)
NetD2_1: D2.1 J19.1 U11.3(D)
NetD3_2: D3.2 R38.2
NetD4_2: D4.2 R39.2
NetD5_2: D5.2 R40.2
NetD6_1: D6.1 J20.1 U12.3(D)
NetR36_2: R36.2 U10.1(G)
NetR37_2: R37.2 U11.1(G)
NetR41_2: R41.2 U12.1(G)

### Notes on the sheet
- (near U10) Power
- (near J17) Test Points
- (near R39) LEDs
- The resistors are sized for an LED current of 2 mA.